# EAGLE schematic OBS-buttons-panel (EAGLE 7.7.0)
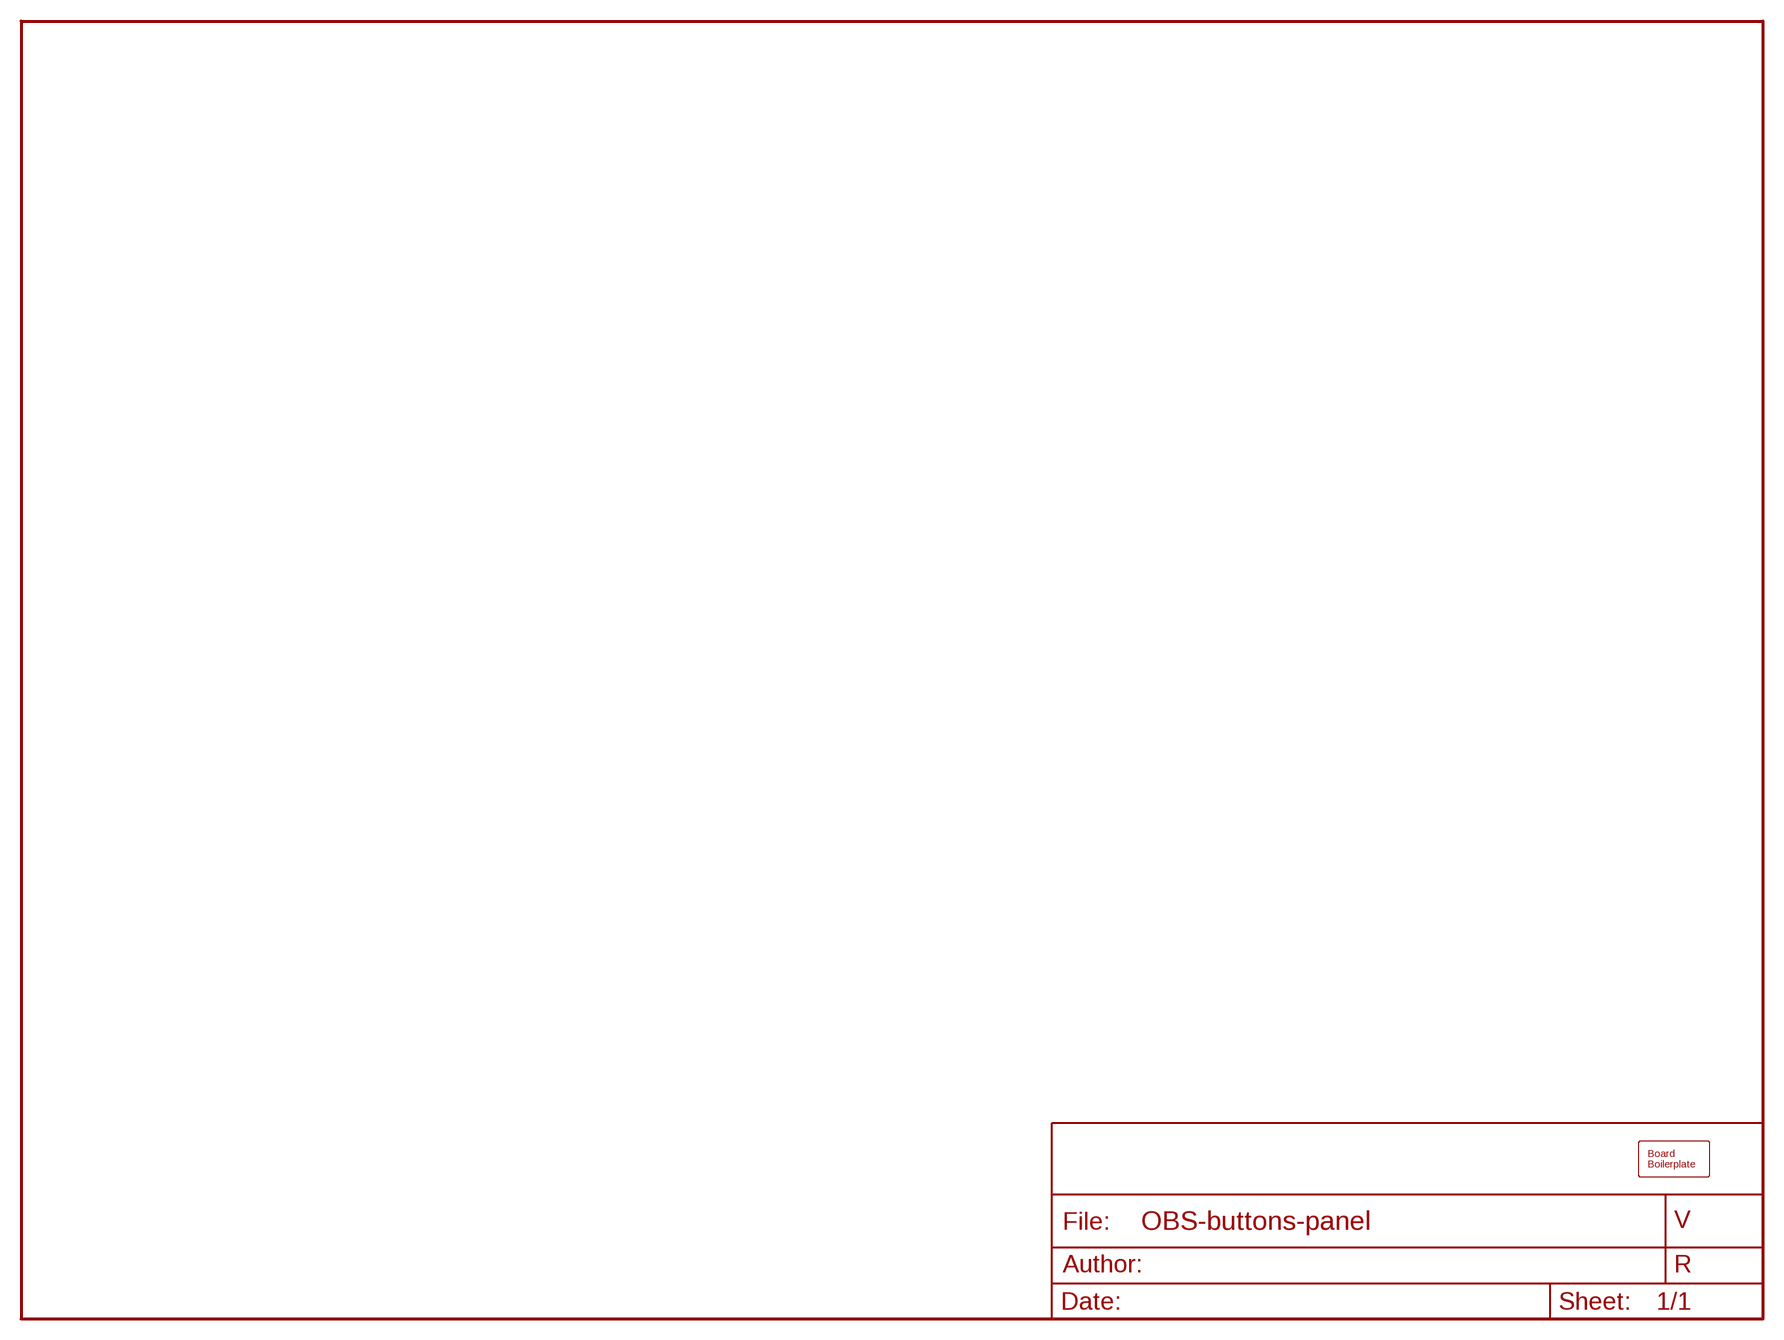
[diagram p0: schematic, sheet 1]

## Parts
BOARD1  BOARD100X50-NOHOLES  [BOARD-SEEED10X5-NOHOLES]

## Library data of the parts
BOARD1 = SPCoast:BOARD